# Altium schematic sheet SCH_DH_7LED.SchDoc
size A3; SheetNumber: 1; SheetTotal: 10
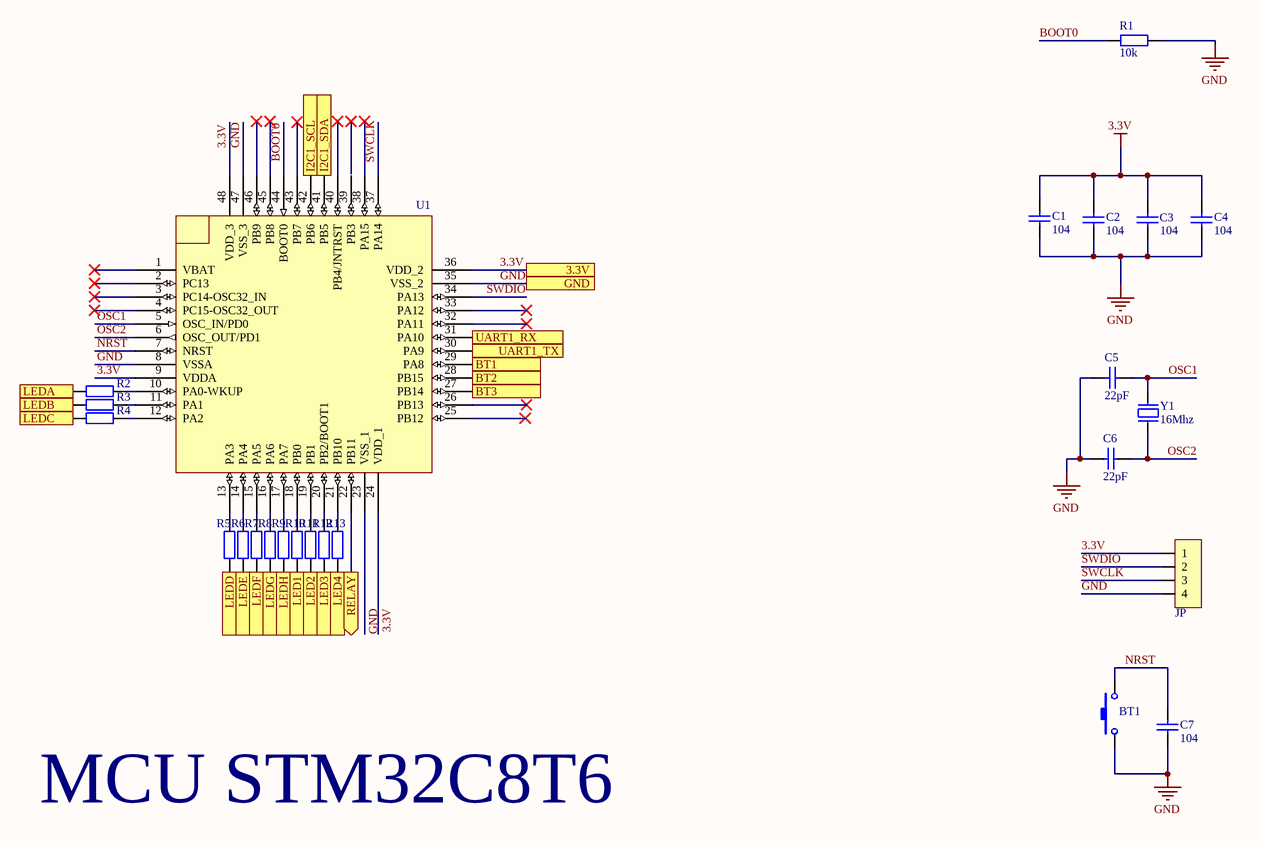
[diagram p0: SCH_DH_7LED.SchDoc]

## Parts
BT1  Nut Nhan 2 Chan SMD 3x6x2.5  [Nut Nhan 2 Chan SMD 3x6x2.5]  (value not drawn)
C1  104  [tu 0805]
C2  104  [tu 0805]
C3  104  [tu 0805]
C4  104  [tu 0805]
C5  22pF  [tu 0805]
C6  22pF  [tu 0805]
C7  104  [tu 0805]
JP1  JP  [JP 1x4 DT]
R1  10k  [tro smd 0805]
R2  (no value)  [tro smd 0603]
R3  (no value)  [tro smd 0603]
R4  (no value)  [tro smd 0603]
R5  (no value)  [tro smd 0603]
R6  (no value)  [tro smd 0603]
R7  (no value)  [tro smd 0603]
R8  (no value)  [tro smd 0603]
R9  (no value)  [tro smd 0603]
R10  (no value)  [tro smd 0603]
R11  (no value)  [tro smd 0603]
R12  (no value)  [tro smd 0603]
R13  (no value)  [tro smd 0603]
U1  (no value)  [STM32_LQPF48]
Y1  16Mhz  [Thach Anh 2 chan SMD]

## Ports
3.3V, BT1 (in), BT2 (in), BT3 (in), GND, I2C1_SCL, I2C1_SDA, LED1 (out), LED2 (out), LED3 (out), LED4 (out), LEDA (out), LEDB (out), LEDC (out), LEDD (out), LEDE (out), LEDF (out), LEDG (out), LEDH (out), RELAY (out), UART1_RX, UART1_TX

## Nets
3.3V: C1.1 C2.1 C3.1 C4.1 JP1.1 U1.9(VDDA) U1.24(VDD_1) U1.36(VDD_2) U1.48(VDD_3) ; port 3.3V
GND: BT1.1 C1.2 C2.2 C3.2 C4.2 C5.2 C6.1 C7.2 JP1.4 R1.1 U1.8(VSSA) U1.23(VSS_1) U1.35(VSS_2) U1.47(VSS_3) ; port GND
BOOT0: R1.2 U1.44(BOOT0)
BT1: U1.29(PA8) ; port BT1
BT2: U1.28(PB15) ; port BT2
BT3: U1.27(PB14) ; port BT3
I2C1_SCL: U1.42(PB6) ; port I2C1_SCL
I2C1_SDA: U1.41(PB5) ; port I2C1_SDA
LED1: R10.1 ; port LED1
LED2: R11.1 ; port LED2
LED3: R12.1 ; port LED3
LED4: R13.1 ; port LED4
LEDA: R2.2 ; port LEDA
LEDB: R3.2 ; port LEDB
LEDC: R4.2 ; port LEDC
LEDD: R5.1 ; port LEDD
LEDE: R6.1 ; port LEDE
LEDF: R7.1 ; port LEDF
LEDG: R8.1 ; port LEDG
LEDH: R9.1 ; port LEDH
NRST: BT1.2 C7.1 U1.7(NRST)
OSC1: C5.1 U1.5(OSC_IN/PD0) Y1.2
OSC2: C6.2 U1.6(OSC_OUT/PD1) Y1.1
RELAY: U1.22(PB11) ; port RELAY
SWCLK: JP1.3 U1.37(PA14)
SWDIO: JP1.2 U1.34(PA13)
UART1_RX: U1.31(PA10) ; port UART1_RX
UART1_TX: U1.30(PA9) ; port UART1_TX
NetR2_1: R2.1 U1.10(PA0-WKUP)
NetR3_1: R3.1 U1.11(PA1)
NetR4_1: R4.1 U1.12(PA2)
NetR5_2: R5.2 U1.13(PA3)
NetR6_2: R6.2 U1.14(PA4)
NetR7_2: R7.2 U1.15(PA5)
NetR8_2: R8.2 U1.16(PA6)
NetR9_2: R9.2 U1.17(PA7)
NetR10_2: R10.2 U1.18(PB0)
NetR11_2: R11.2 U1.19(PB1)
NetR12_2: R12.2 U1.20(PB2/BOOT1)
NetR13_2: R13.2 U1.21(PB10)

Not connected (* = marked no-connect by the designer): U1 1(VBAT)* 2(PC13)* 3(PC14-OSC32_IN)* 4(PC15-OSC32_OUT)* 25(PB12)* 26(PB13)* 32(PA11)* 33(PA12)* 38(PA15)* 39(PB3) 40(PB4/JNTRST)* 43(PB7)* 45(PB8)* 46(PB9)*

## Notes on the sheet
- MCU STM32C8T6

## Library data of the parts
BT1 = Nut Nhan 2 Chan SMD 3x6x2.5: Ma_Hang: MH001036; Ten: Nút Nhấn 2 Chân 3x6x2.5MM SMD
C1-C4 C7 = Tu 0805 104 50V 10%: Dán; Don_Vi: Con; So_Chan: 2; Ten_Linh_Kien: Tụ 0805 104-100nF 10% 50V; Ma_Hang: MH004551; Chung_Loai: Dán; Kieu_Chan: *
C5 C6 = Tu 0805 22pF 50V 10%: Dán; Don_Vi: Con; So_Chan: 2; Ten_Linh_Kien: Tụ 0805 22P 10% 50V; Ma_Hang: MH004560; Chung_Loai: Dán; Kieu_Chan: *
JP1 = JP 1x4 2.54 Duc Thang: Cắm; Ten_Linh_Kien: Jump Đơn Đực 2.54MM 1x40P Thẳng 11MM; Don_Vi: Con; Ma_Hang: MH000903; Ghi_Chu: *; Kieu_Chan: *; Chung_Loai: Cắm
R1 = Tro 0805 5% 10k: Dán; Don_Vi: Con; So_Chan: 2; Ten_Linh_Kien: Trở 0805 5% 10k; Ma_Hang: MH005239; Chung_Loai: Dán; Kieu_Chan: *
R2-R13 = Tro 0603 5% 100R: Dán; Don_Vi: Con; So_Chan: 2; Ten_Linh_Kien: Trở 0603 5% 100R; Ma_Hang: MH006315; Chung_Loai: Dán; Kieu_Chan: *
U1 = STM32F103xx_LQFP48: Published: 30-May-2008; DatasheetVersion: rev6, Mar-2008; PackageVersion: Mar-2008; PackageReference: LQFP48; Publisher: Altium Limited; PackageDescription: 48-Pin Low-Profile Quad Flat Pack, 7 x 7 mm Body, 0.5 mm Pitch (LQFP48); ComponentLink1Description: Manufacturer Link; ComponentLink1URL: www.st.com/stm32; ComponentLink2Description: Datasheet; ComponentLink2URL: http://www.st.com/stonline/products/literature/ds/13587.pdf
Y1 = Thach Anh 2 chan SMD: Crystal For all Crystal 2pin.; Value: 4Mhz